# Altium schematic sheet CPLD.SchDoc
size A2; Date: Date; CompanyName: HESSO; Engineer: Name; Address1: Route du Rawyl 47; Address2: 1950 Sion; Address3: Switzerland; DocumentNumber: 3; SheetNumber: 3; SheetTotal: 8; ProjectName: Project Name
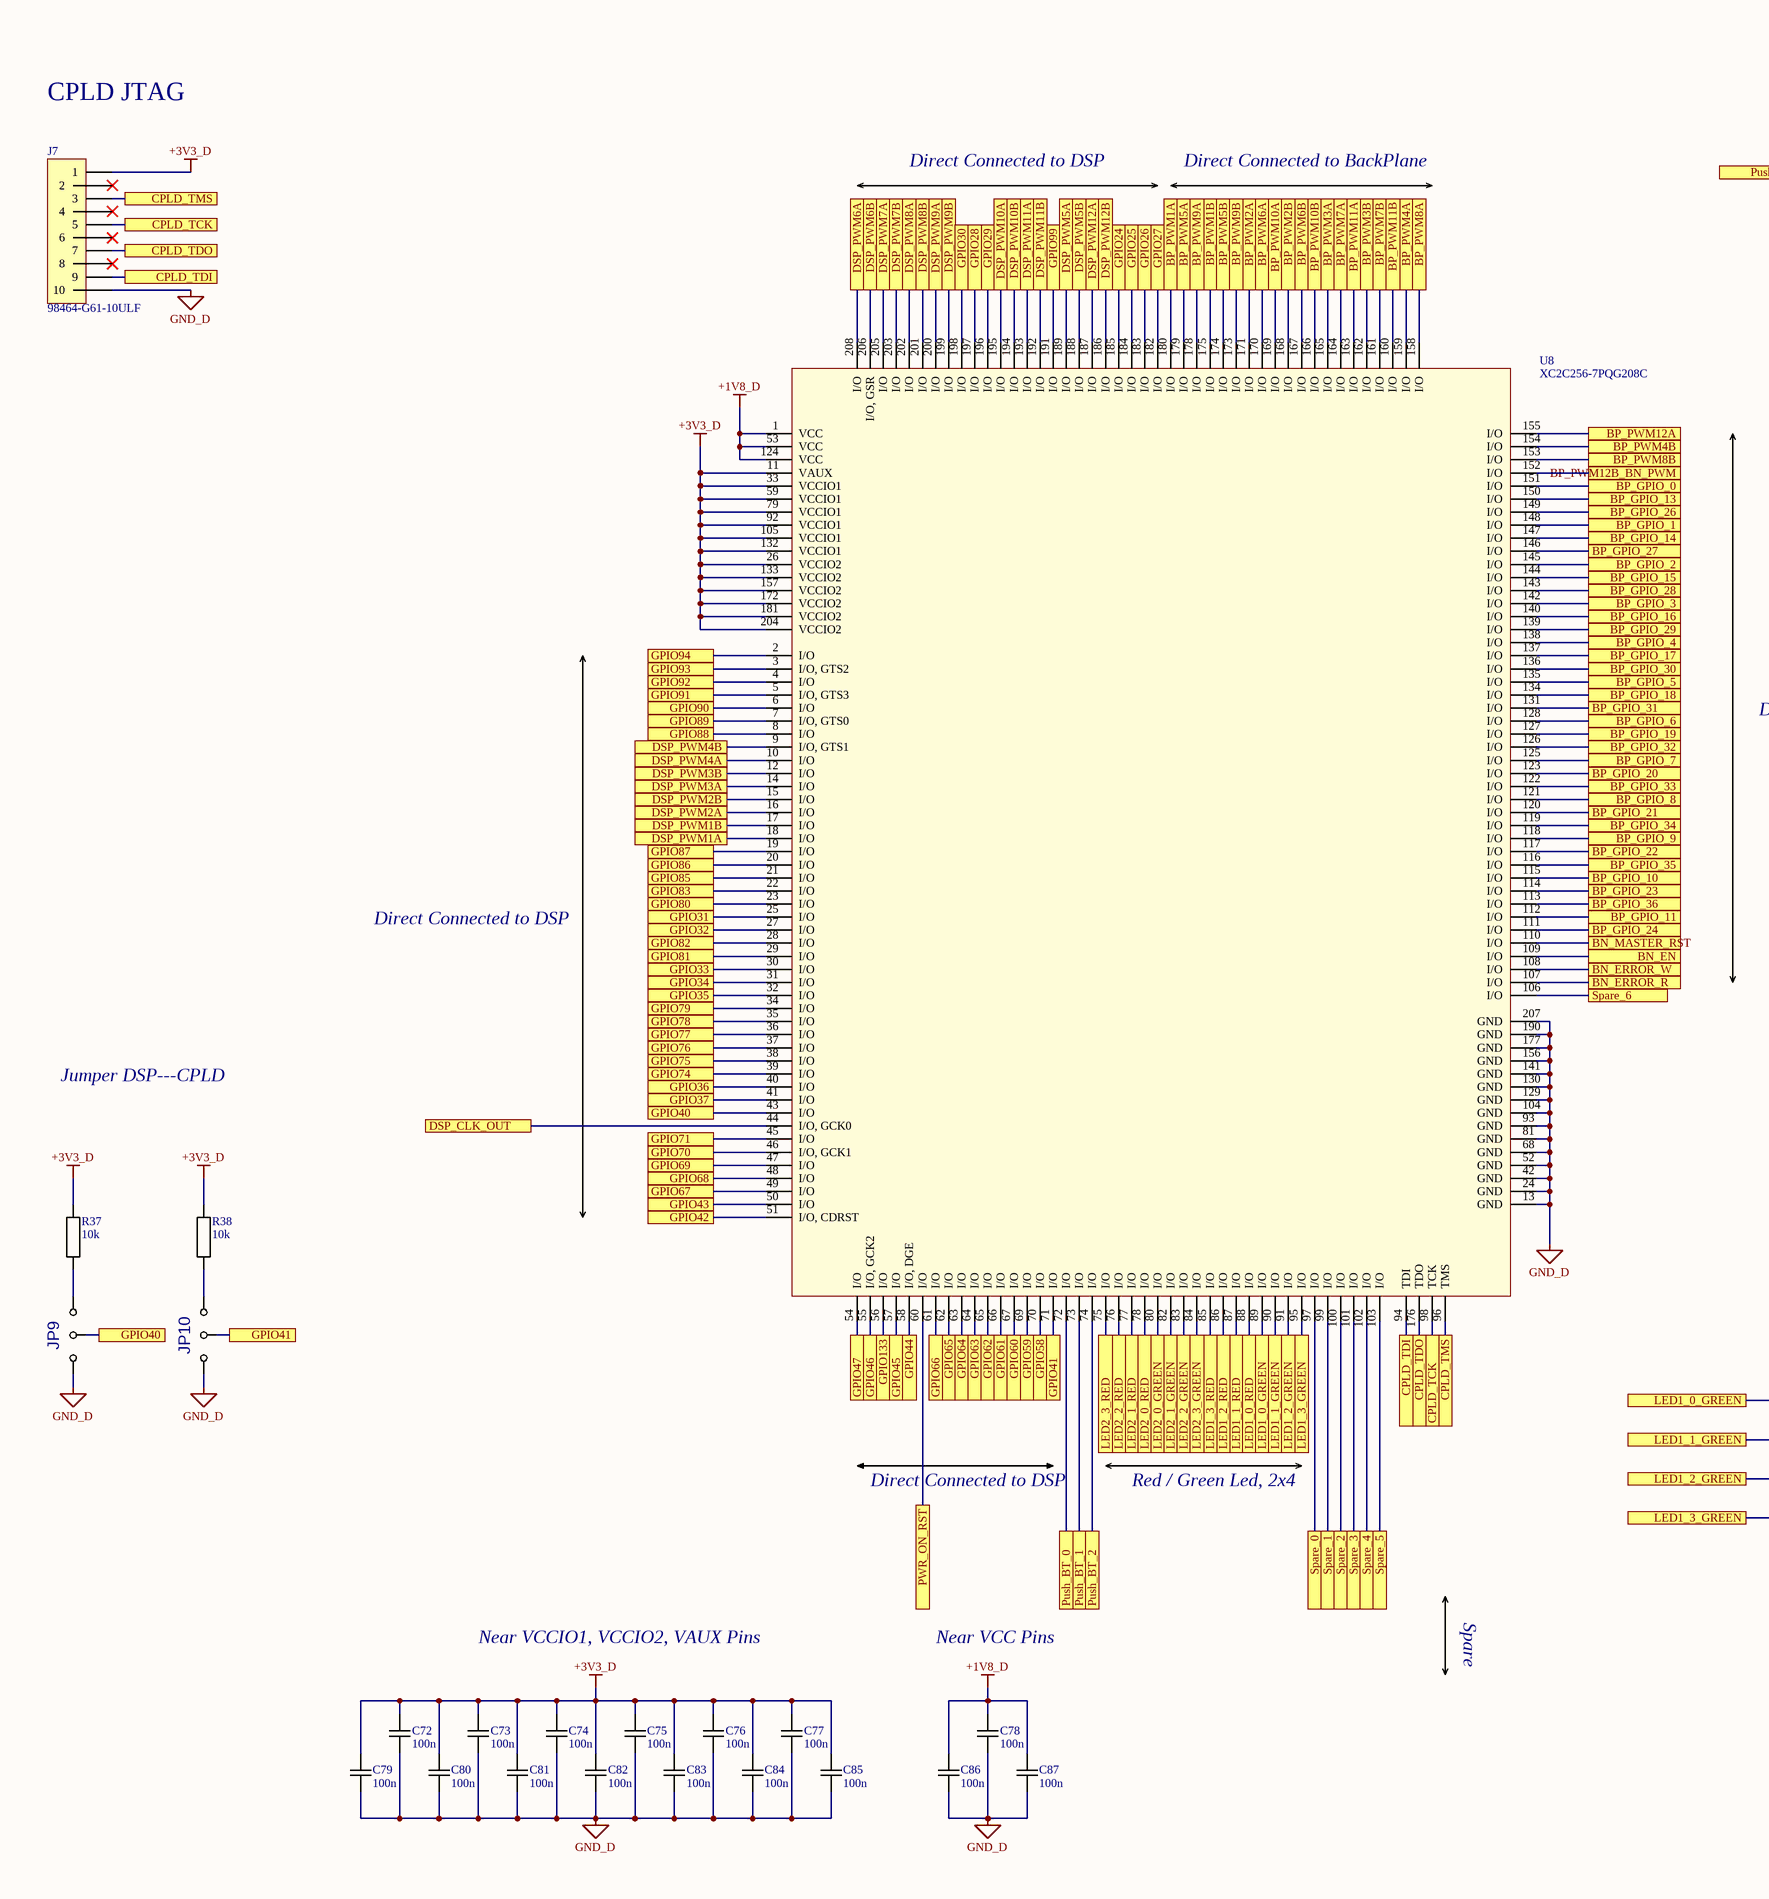
[diagram p0: CPLD.SchDoc, left]
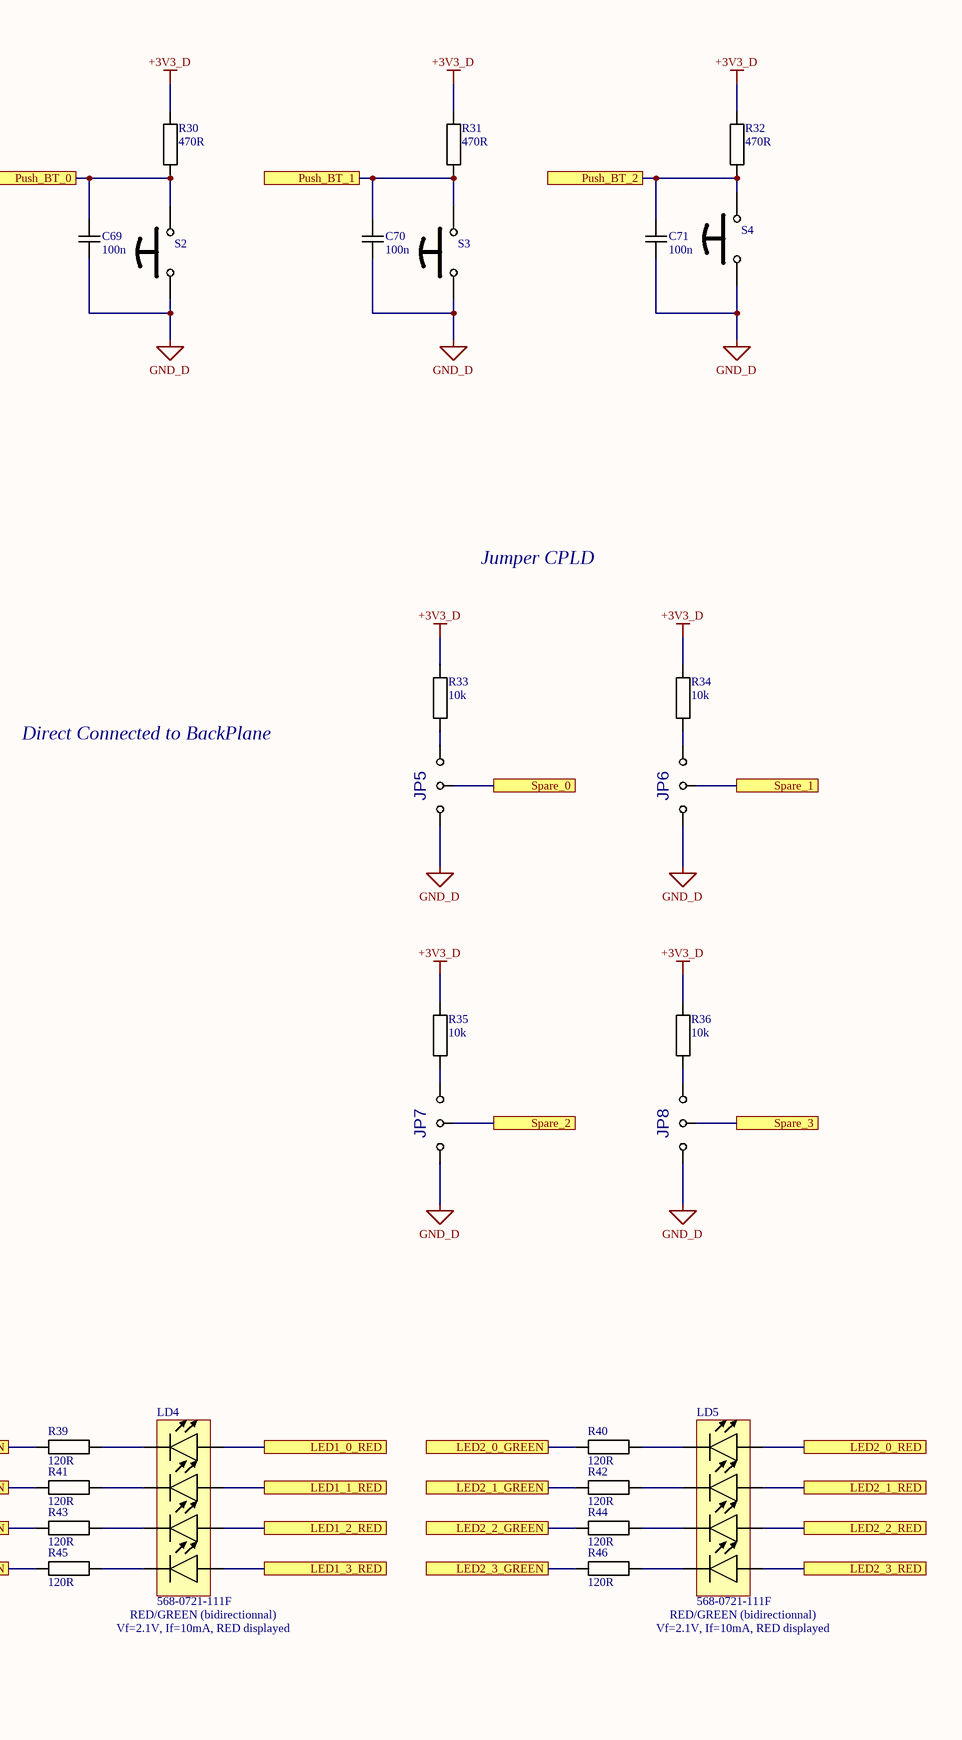
[diagram p1: CPLD.SchDoc, right]

## Parts
C69  100n  [CAPACITOR 2012 REFLOW]
C70  100n  [CAPACITOR 2012 REFLOW]
C71  100n  [CAPACITOR 2012 REFLOW]
C72  100n  [CAPACITOR 1608 REFLOW]
C73  100n  [CAPACITOR 1608 REFLOW]
C74  100n  [CAPACITOR 1608 REFLOW]
C75  100n  [CAPACITOR 1608 REFLOW]
C76  100n  [CAPACITOR 1608 REFLOW]
C77  100n  [CAPACITOR 1608 REFLOW]
C78  100n  [CAPACITOR 1608 REFLOW]
C79  100n  [CAPACITOR 1608 REFLOW]
C80  100n  [CAPACITOR 1608 REFLOW]
C81  100n  [CAPACITOR 1608 REFLOW]
C82  100n  [CAPACITOR 1608 REFLOW]
C83  100n  [CAPACITOR 1608 REFLOW]
C84  100n  [CAPACITOR 1608 REFLOW]
C85  100n  [CAPACITOR 1608 REFLOW]
C86  100n  [CAPACITOR 1608 REFLOW]
C87  100n  [CAPACITOR 1608 REFLOW]
J7  98464-G61-10ULF  [FlatCable2x5 2MM Right Angle TH FCI 98614-G61-10ULF]
JP5  {Value}  [JUMPER3 TH]  (value not drawn)
JP6  {Value}  [JUMPER3 TH]  (value not drawn)
JP7  {Value}  [JUMPER3 TH]  (value not drawn)
JP8  {Value}  [JUMPER3 TH]  (value not drawn)
JP9  {Value}  [JUMPER3 TH]  (value not drawn)
JP10  {Value}  [JUMPER3 TH]  (value not drawn)
LD4  568-0721-111F  [LED Dialight 568-0721-111]
LD5  568-0721-111F  [LED Dialight 568-0721-111]
R30  470R  [RESISTOR 2012 REFLOW]
R31  470R  [RESISTOR 2012 REFLOW]
R32  470R  [RESISTOR 2012 REFLOW]
R33  10k  [RESISTOR 2012 REFLOW]
R34  10k  [RESISTOR 2012 REFLOW]
R35  10k  [RESISTOR 2012 REFLOW]
R36  10k  [RESISTOR 2012 REFLOW]
R37  10k  [RESISTOR 2012 REFLOW]
R38  10k  [RESISTOR 2012 REFLOW]
R39  120R  [RESISTOR 1608 REFLOW]
R40  120R  [RESISTOR 1608 REFLOW]
R41  120R  [RESISTOR 1608 REFLOW]
R42  120R  [RESISTOR 1608 REFLOW]
R43  120R  [RESISTOR 1608 REFLOW]
R44  120R  [RESISTOR 1608 REFLOW]
R45  120R  [RESISTOR 1608 REFLOW]
R46  120R  [RESISTOR 1608 REFLOW]
S2  FSMRA4JH04  [Push Button C7.1x3.7 TE FSMRA4JH]  (value not drawn)
S3  FSMRA4JH04  [Push Button C7.1x3.7 TE FSMRA4JH]  (value not drawn)
S4  FSMRA4JH04  [Push Button C7.1x3.7 TE FSMRA4JH]  (value not drawn)
U8  XC2C256-7PQG208C  [PQFP208 P0.5 C28.0X28.0 H3.7]

## Ports
BN_EN, BN_ERROR_R, BN_ERROR_W, BN_MASTER_RST, BP_GPIO_0, BP_GPIO_1, BP_GPIO_2, BP_GPIO_3, BP_GPIO_4, BP_GPIO_5, BP_GPIO_6, BP_GPIO_7, BP_GPIO_8, BP_GPIO_9, BP_GPIO_10, BP_GPIO_11, BP_GPIO_13, BP_GPIO_14, BP_GPIO_15, BP_GPIO_16, BP_GPIO_17, BP_GPIO_18, BP_GPIO_19, BP_GPIO_20, BP_GPIO_21, BP_GPIO_22, BP_GPIO_23, BP_GPIO_24, BP_GPIO_26, BP_GPIO_27, BP_GPIO_28, BP_GPIO_29, BP_GPIO_30, BP_GPIO_31, BP_GPIO_32, BP_GPIO_33, BP_GPIO_34, BP_GPIO_35, BP_GPIO_36, BP_PWM1A, BP_PWM1B, BP_PWM2A, BP_PWM2B, BP_PWM3A, BP_PWM3B, BP_PWM4A, BP_PWM4B, BP_PWM5A, BP_PWM5B, BP_PWM6A, BP_PWM6B, BP_PWM7A, BP_PWM7B, BP_PWM8A, BP_PWM8B, BP_PWM9A, BP_PWM9B, BP_PWM10A, BP_PWM10B, BP_PWM11A, BP_PWM11B, BP_PWM12A, BP_PWM12B_BN_PWM, CPLD_TCK, CPLD_TDI, CPLD_TDO, CPLD_TMS, DSP_CLK_OUT, DSP_PWM1A, DSP_PWM1B, DSP_PWM2A, DSP_PWM2B, DSP_PWM3A, DSP_PWM3B, DSP_PWM4A, DSP_PWM4B, DSP_PWM5A, DSP_PWM5B, DSP_PWM6A, DSP_PWM6B, DSP_PWM7A, DSP_PWM7B, DSP_PWM8A, DSP_PWM8B, DSP_PWM9A, DSP_PWM9B, DSP_PWM10A, DSP_PWM10B, DSP_PWM11A, DSP_PWM11B, DSP_PWM12A, DSP_PWM12B, GPIO24, GPIO25, GPIO26, GPIO27, GPIO28, GPIO29, GPIO30, GPIO31, GPIO32, GPIO33, GPIO34, GPIO35, GPIO36, GPIO37, GPIO40, GPIO41, GPIO42, GPIO43, GPIO44, GPIO45, GPIO46, GPIO47, GPIO58, GPIO59, GPIO60, GPIO61, GPIO62, GPIO63, GPIO64, GPIO65, GPIO66, GPIO67, GPIO68, GPIO69, GPIO70, GPIO71, GPIO74, GPIO75, GPIO76, GPIO77, GPIO78, GPIO79, GPIO80, GPIO81, GPIO82, GPIO83, GPIO85, GPIO86, GPIO87, GPIO88, GPIO89, GPIO90, GPIO91, GPIO92, GPIO93, GPIO94, GPIO99, GPIO133, LED1_0_GREEN, LED1_0_RED, LED1_1_GREEN, LED1_1_RED, LED1_2_GREEN, LED1_2_RED, LED1_3_GREEN, LED1_3_RED, LED2_0_GREEN, LED2_0_RED, LED2_1_GREEN, LED2_1_RED, LED2_2_GREEN, LED2_2_RED, LED2_3_GREEN, LED2_3_RED, Push_BT_0, Push_BT_1, Push_BT_2, PWR_ON_RST, Spare_0, Spare_1, Spare_2, Spare_3, Spare_4, Spare_5, Spare_6

## Nets
+1V8_D: C78.2 C86.2 C87.2 U8.1(VCC) U8.53(VCC) U8.124(VCC)
+3V3_D: C72.2 C73.2 C74.2 C75.2 C76.2 C77.2 C79.2 C80.2 C81.2 C82.2 C83.2 C84.2 C85.2 J7.1 R30.2 R31.2 R32.2 R33.2 R34.2 R35.2 R36.2 R37.1 R38.1 U8.11(VAUX) U8.26(VCCIO2) U8.33(VCCIO1) U8.59(VCCIO1) U8.79(VCCIO1) U8.92(VCCIO1) U8.105(VCCIO1) U8.132(VCCIO1) U8.133(VCCIO2) U8.157(VCCIO2) U8.172(VCCIO2) U8.181(VCCIO2) U8.204(VCCIO2)
GND_D: C69.1 C70.1 C71.1 C72.1 C73.1 C74.1 C75.1 C76.1 C77.1 C78.1 C79.1 C80.1 C81.1 C82.1 C83.1 C84.1 C85.1 C86.1 C87.1 J7.10 JP5.1 JP6.1 JP7.1 JP8.1 JP9.1 JP10.1 S2.1 S3.1 S4.1 U8.13(GND) U8.24(GND) U8.42(GND) U8.52(GND) U8.68(GND) U8.81(GND) U8.93(GND) U8.104(GND) U8.129(GND) U8.130(GND) U8.141(GND) U8.156(GND) U8.177(GND) U8.190(GND) U8.207(GND)
BN_EN: U8.109(I/O) ; port BN_EN
BN_ERROR_R: U8.107(I/O) ; port BN_ERROR_R
BN_ERROR_W: U8.108(I/O) ; port BN_ERROR_W
BN_MASTER_RST: U8.110(I/O) ; port BN_MASTER_RST
BP_GPIO_0: U8.151(I/O) ; port BP_GPIO_0
BP_GPIO_1: U8.148(I/O) ; port BP_GPIO_1
BP_GPIO_2: U8.145(I/O) ; port BP_GPIO_2
BP_GPIO_3: U8.142(I/O) ; port BP_GPIO_3
BP_GPIO_4: U8.138(I/O) ; port BP_GPIO_4
BP_GPIO_5: U8.135(I/O) ; port BP_GPIO_5
BP_GPIO_6: U8.128(I/O) ; port BP_GPIO_6
BP_GPIO_7: U8.125(I/O) ; port BP_GPIO_7
BP_GPIO_8: U8.121(I/O) ; port BP_GPIO_8
BP_GPIO_9: U8.118(I/O) ; port BP_GPIO_9
BP_GPIO_10: U8.115(I/O) ; port BP_GPIO_10
BP_GPIO_11: U8.112(I/O) ; port BP_GPIO_11
BP_GPIO_13: U8.150(I/O) ; port BP_GPIO_13
BP_GPIO_14: U8.147(I/O) ; port BP_GPIO_14
BP_GPIO_15: U8.144(I/O) ; port BP_GPIO_15
BP_GPIO_16: U8.140(I/O) ; port BP_GPIO_16
BP_GPIO_17: U8.137(I/O) ; port BP_GPIO_17
BP_GPIO_18: U8.134(I/O) ; port BP_GPIO_18
BP_GPIO_19: U8.127(I/O) ; port BP_GPIO_19
BP_GPIO_20: U8.123(I/O) ; port BP_GPIO_20
BP_GPIO_21: U8.120(I/O) ; port BP_GPIO_21
BP_GPIO_22: U8.117(I/O) ; port BP_GPIO_22
BP_GPIO_23: U8.114(I/O) ; port BP_GPIO_23
BP_GPIO_24: U8.111(I/O) ; port BP_GPIO_24
BP_GPIO_26: U8.149(I/O) ; port BP_GPIO_26
BP_GPIO_27: U8.146(I/O) ; port BP_GPIO_27
BP_GPIO_28: U8.143(I/O) ; port BP_GPIO_28
BP_GPIO_29: U8.139(I/O) ; port BP_GPIO_29
BP_GPIO_30: U8.136(I/O) ; port BP_GPIO_30
BP_GPIO_31: U8.131(I/O) ; port BP_GPIO_31
BP_GPIO_32: U8.126(I/O) ; port BP_GPIO_32
BP_GPIO_33: U8.122(I/O) ; port BP_GPIO_33
BP_GPIO_34: U8.119(I/O) ; port BP_GPIO_34
BP_GPIO_35: U8.116(I/O) ; port BP_GPIO_35
BP_GPIO_36: U8.113(I/O) ; port BP_GPIO_36
BP_PWM1A: U8.180(I/O) ; port BP_PWM1A
BP_PWM1B: U8.175(I/O) ; port BP_PWM1B
BP_PWM2A: U8.171(I/O) ; port BP_PWM2A
BP_PWM2B: U8.168(I/O) ; port BP_PWM2B
BP_PWM3A: U8.165(I/O) ; port BP_PWM3A
BP_PWM3B: U8.162(I/O) ; port BP_PWM3B
BP_PWM4A: U8.159(I/O) ; port BP_PWM4A
BP_PWM4B: U8.154(I/O) ; port BP_PWM4B
BP_PWM5A: U8.179(I/O) ; port BP_PWM5A
BP_PWM5B: U8.174(I/O) ; port BP_PWM5B
BP_PWM6A: U8.170(I/O) ; port BP_PWM6A
BP_PWM6B: U8.167(I/O) ; port BP_PWM6B
BP_PWM7A: U8.164(I/O) ; port BP_PWM7A
BP_PWM7B: U8.161(I/O) ; port BP_PWM7B
BP_PWM8A: U8.158(I/O) ; port BP_PWM8A
BP_PWM8B: U8.153(I/O) ; port BP_PWM8B
BP_PWM9A: U8.178(I/O) ; port BP_PWM9A
BP_PWM9B: U8.173(I/O) ; port BP_PWM9B
BP_PWM10A: U8.169(I/O) ; port BP_PWM10A
BP_PWM10B: U8.166(I/O) ; port BP_PWM10B
BP_PWM11A: U8.163(I/O) ; port BP_PWM11A
BP_PWM11B: U8.160(I/O) ; port BP_PWM11B
BP_PWM12A: U8.155(I/O) ; port BP_PWM12A
BP_PWM12B_BN_PWM: U8.152(I/O) ; port BP_PWM12B_BN_PWM
CPLD_TCK: J7.5 U8.98(TCK) ; port CPLD_TCK
CPLD_TDI: J7.9 U8.94(TDI) ; port CPLD_TDI
CPLD_TDO: J7.7 U8.176(TDO) ; port CPLD_TDO
CPLD_TMS: J7.3 U8.96(TMS) ; port CPLD_TMS
DSP_CLK_OUT: U8.44(I/O,_GCK0) ; port DSP_CLK_OUT
DSP_PWM1A: U8.18(I/O) ; port DSP_PWM1A
DSP_PWM1B: U8.17(I/O) ; port DSP_PWM1B
DSP_PWM2A: U8.16(I/O) ; port DSP_PWM2A
DSP_PWM2B: U8.15(I/O) ; port DSP_PWM2B
DSP_PWM3A: U8.14(I/O) ; port DSP_PWM3A
DSP_PWM3B: U8.12(I/O) ; port DSP_PWM3B
DSP_PWM4A: U8.10(I/O) ; port DSP_PWM4A
DSP_PWM4B: U8.9(I/O,_GTS1) ; port DSP_PWM4B
DSP_PWM5A: U8.189(I/O) ; port DSP_PWM5A
DSP_PWM5B: U8.188(I/O) ; port DSP_PWM5B
DSP_PWM6A: U8.208(I/O) ; port DSP_PWM6A
DSP_PWM6B: U8.206(I/O,_GSR) ; port DSP_PWM6B
DSP_PWM7A: U8.205(I/O) ; port DSP_PWM7A
DSP_PWM7B: U8.203(I/O) ; port DSP_PWM7B
DSP_PWM8A: U8.202(I/O) ; port DSP_PWM8A
DSP_PWM8B: U8.201(I/O) ; port DSP_PWM8B
DSP_PWM9A: U8.200(I/O) ; port DSP_PWM9A
DSP_PWM9B: U8.199(I/O) ; port DSP_PWM9B
DSP_PWM10A: U8.195(I/O) ; port DSP_PWM10A
DSP_PWM10B: U8.194(I/O) ; port DSP_PWM10B
DSP_PWM11A: U8.193(I/O) ; port DSP_PWM11A
DSP_PWM11B: U8.192(I/O) ; port DSP_PWM11B
DSP_PWM12A: U8.187(I/O) ; port DSP_PWM12A
DSP_PWM12B: U8.186(I/O) ; port DSP_PWM12B
GPIO24: U8.185(I/O) ; port GPIO24
GPIO25: U8.184(I/O) ; port GPIO25
GPIO26: U8.183(I/O) ; port GPIO26
GPIO27: U8.182(I/O) ; port GPIO27
GPIO28: U8.197(I/O) ; port GPIO28
GPIO29: U8.196(I/O) ; port GPIO29
GPIO30: U8.198(I/O) ; port GPIO30
GPIO31: U8.25(I/O) ; port GPIO31
GPIO32: U8.27(I/O) ; port GPIO32
GPIO33: U8.30(I/O) ; port GPIO33
GPIO34: U8.31(I/O) ; port GPIO34
GPIO35: U8.32(I/O) ; port GPIO35
GPIO36: U8.40(I/O) ; port GPIO36
GPIO37: U8.41(I/O) ; port GPIO37
GPIO40: JP9.2 U8.43(I/O) ; port GPIO40
GPIO41: JP10.2 U8.71(I/O) ; port GPIO41
GPIO42: U8.51(I/O,_CDRST) ; port GPIO42
GPIO43: U8.50(I/O) ; port GPIO43
GPIO44: U8.58(I/O,_DGE) ; port GPIO44
GPIO45: U8.57(I/O) ; port GPIO45
GPIO46: U8.55(I/O,_GCK2) ; port GPIO46
GPIO47: U8.54(I/O) ; port GPIO47
GPIO58: U8.70(I/O) ; port GPIO58
GPIO59: U8.69(I/O) ; port GPIO59
GPIO60: U8.67(I/O) ; port GPIO60
GPIO61: U8.66(I/O) ; port GPIO61
GPIO62: U8.65(I/O) ; port GPIO62
GPIO63: U8.64(I/O) ; port GPIO63
GPIO64: U8.63(I/O) ; port GPIO64
GPIO65: U8.62(I/O) ; port GPIO65
GPIO66: U8.61(I/O) ; port GPIO66
GPIO67: U8.49(I/O) ; port GPIO67
GPIO68: U8.48(I/O) ; port GPIO68
GPIO69: U8.47(I/O) ; port GPIO69
GPIO70: U8.46(I/O,_GCK1) ; port GPIO70
GPIO71: U8.45(I/O) ; port GPIO71
GPIO74: U8.39(I/O) ; port GPIO74
GPIO75: U8.38(I/O) ; port GPIO75
GPIO76: U8.37(I/O) ; port GPIO76
GPIO77: U8.36(I/O) ; port GPIO77
GPIO78: U8.35(I/O) ; port GPIO78
GPIO79: U8.34(I/O) ; port GPIO79
GPIO80: U8.23(I/O) ; port GPIO80
GPIO81: U8.29(I/O) ; port GPIO81
GPIO82: U8.28(I/O) ; port GPIO82
GPIO83: U8.22(I/O) ; port GPIO83
GPIO85: U8.21(I/O) ; port GPIO85
GPIO86: U8.20(I/O) ; port GPIO86
GPIO87: U8.19(I/O) ; port GPIO87
GPIO88: U8.8(I/O) ; port GPIO88
GPIO89: U8.7(I/O,_GTS0) ; port GPIO89
GPIO90: U8.6(I/O) ; port GPIO90
GPIO91: U8.5(I/O,_GTS3) ; port GPIO91
GPIO92: U8.4(I/O) ; port GPIO92
GPIO93: U8.3(I/O,_GTS2) ; port GPIO93
GPIO94: U8.2(I/O) ; port GPIO94
GPIO99: U8.191(I/O) ; port GPIO99
GPIO133: U8.56(I/O) ; port GPIO133
LED1_0_GREEN: R39.1 U8.89(I/O) ; port LED1_0_GREEN
LED1_0_RED: LD4.8(A) U8.88(I/O) ; port LED1_0_RED
LED1_1_GREEN: R41.1 U8.90(I/O) ; port LED1_1_GREEN
LED1_1_RED: LD4.6(A) U8.87(I/O) ; port LED1_1_RED
LED1_2_GREEN: R43.1 U8.91(I/O) ; port LED1_2_GREEN
LED1_2_RED: LD4.4(A) U8.86(I/O) ; port LED1_2_RED
LED1_3_GREEN: R45.1 U8.95(I/O) ; port LED1_3_GREEN
LED1_3_RED: LD4.2(A) U8.85(I/O) ; port LED1_3_RED
LED2_0_GREEN: R40.1 U8.80(I/O) ; port LED2_0_GREEN
LED2_0_RED: LD5.8(A) U8.78(I/O) ; port LED2_0_RED
LED2_1_GREEN: R42.1 U8.82(I/O) ; port LED2_1_GREEN
LED2_1_RED: LD5.6(A) U8.77(I/O) ; port LED2_1_RED
LED2_2_GREEN: R44.1 U8.83(I/O) ; port LED2_2_GREEN
LED2_2_RED: LD5.4(A) U8.76(I/O) ; port LED2_2_RED
LED2_3_GREEN: R46.1 U8.84(I/O) ; port LED2_3_GREEN
LED2_3_RED: LD5.2(A) U8.75(I/O) ; port LED2_3_RED
Push_BT_0: C69.2 R30.1 S2.2 U8.72(I/O) ; port Push_BT_0
Push_BT_1: C70.2 R31.1 S3.2 U8.73(I/O) ; port Push_BT_1
Push_BT_2: C71.2 R32.1 S4.2 U8.74(I/O) ; port Push_BT_2
PWR_ON_RST: U8.60(I/O) ; port PWR_ON_RST
Spare_0: JP5.2 U8.97(I/O) ; port Spare_0
Spare_1: JP6.2 U8.99(I/O) ; port Spare_1
Spare_2: JP7.2 U8.100(I/O) ; port Spare_2
Spare_3: JP8.2 U8.101(I/O) ; port Spare_3
Spare_4: U8.102(I/O) ; port Spare_4
Spare_5: U8.103(I/O) ; port Spare_5
Spare_6: U8.106(I/O) ; port Spare_6
NetJP5_3: JP5.3 R33.1
NetJP6_3: JP6.3 R34.1
NetJP7_3: JP7.3 R35.1
NetJP8_3: JP8.3 R36.1
NetJP9_3: JP9.3 R37.2
NetJP10_3: JP10.3 R38.2
NetLD4_1: LD4.1(C) R45.2
NetLD4_3: LD4.3(C) R43.2
NetLD4_5: LD4.5(C) R41.2
NetLD4_7: LD4.7(C) R39.2
NetLD5_1: LD5.1(C) R46.2
NetLD5_3: LD5.3(C) R44.2
NetLD5_5: LD5.5(C) R42.2
NetLD5_7: LD5.7(C) R40.2

Not connected (* = marked no-connect by the designer): J7 2* 4* 6* 8*

## Notes on the sheet
- CPLD JTAG
- Direct Connected to DSP
- Direct Connected to BackPlane
- Jumper CPLD
- Jumper DSP---CPLD
- Red / Green Led, 2x4
- Spare
- Vf=2.1V, If=10mA, RED displayed
- RED/GREEN (bidirectionnal)
- Near VCCIO1, VCCIO2, VAUX Pins
- Near VCC Pins
- Date :
- Revision :
- Sheet
- of
- Design by :

## Library data of the parts
C69-C71 = Capacitor: Capacitor X7R 10% 50V 2012(0805); Value: 100n
C72-C87 = Capacitor: Capacitor X7R 10% 50V 1608(0603); Value: 100n
J7 = FlatCable2x5: Manufacturer: Amphenol FCI; Mouser No.: 649-98464-G6110ULF; Value: 98464-G61-10ULF
JP5-JP10 = JUMPER 3 POS: Value: {Value}
LD4 LD5 = LED Dialight 568-0721-111F: Value: 568-0721-111F; Manufacturer: Dialight; Mouser No.: 645-568-0721-111F
R30-R38 = Resistor: Resistor 1% 50V 125mW 2012(0805)
  R30-R32: Value: 470R
  R33-R38: Value: 10k
R39-R46 = Resistor: Resistor 1% 50V 100mW 1608(0603); Value: 120R
S2-S4 = Push Button 2Pins: Push Button, 2 pins; Manufacturer: TE Connectivity / Alcoswitch; Value: FSMRA4JH04; Mouser No.: 506-FSMRA4JH04
U8 = XC2C256-PQFP208: XC2C256 CoolRunner-II CPLD; Manufacturer: Xilinx; value: XC2C256-7PQG208C; Digikey No.: 122-1411-ND